# Altium schematic sheet OpAMP.SchDoc
size A4
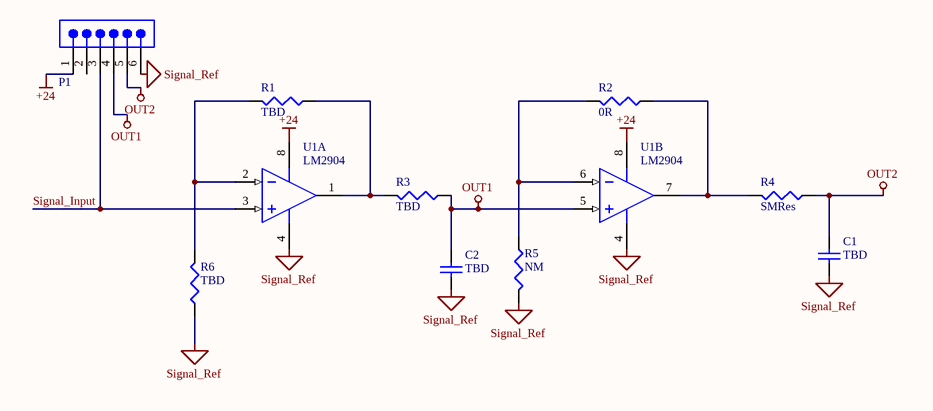
[diagram p0: OpAMP.SchDoc]

## Parts
C1  TBD  [WCAP-CSGP_0805_L2W1.25H0.6_Reflow]
C2  TBD  [WCAP-CSGP_0805_L2W1.25H0.6_Reflow]
P1  61300611121  [61300611121]  (value not drawn)
R1  TBD  [SM/R_1206]
R2  0R  [SM/R_1206]
R3  TBD  [SM/R_1206]
R4  SMRes  [SM/R_1206]
R5  NM  [SM/R_1206]
R6  TBD  [SM/R_1206]
U1  LM2904  [SO8_N]  (parts A,B of 2)

## Nets
+24: P1.1 U1.8(V+)
OUT1: C2.2 P1.4 R3.1 U1.5(IN+)
OUT2: C1.2 P1.5 R4.1
Signal_Ref: C1.1 C2.1 P1.6 R5.2 R6.1 U1.4(V-)
Signal_Input: P1.3 U1.3(IN+)
NetR1_1: R1.1 R3.2 U1.1(OUT)
NetR1_2: R1.2 R6.2 U1.2(IN-)
NetR2_1: R2.1 R4.2 U1.7(OUT)
NetR2_2: R2.2 R5.1 U1.6(IN-)

Not connected (* = marked no-connect by the designer): P1 2

## Library data of the parts
C1 C2 = 885012007032: WCAP-CSGP Multilayer Ceramic Chip Capacitor, General Purpose, size 0805, NP0, 47pF, 25VDC; Manufacturer: Wurth Elektronik; Case/Size Code: 0805; Capacitance Tolerance: +/-5%; Insulation Resistance: 10GΩ; Q Factor: 1000; Rated Voltage (DC): 25V; Technical Reference: NP00805470J025DFCT10000; Manufacturer Part Number: 885012007032; Category: Multilayer Ceramic Chip Capacitors; Match Code: WCAP-CSGP; ComponentLink1Description: Website Link; ComponentLink1URL: https://www.we-online.com/redexpert/article/885012007032?ad; ComponentLink2Description: Datasheet Link; ComponentLink2URL: https://www.we-online.com/redexpert/spec/885012007032?ad; Mount: Surface Mount; Operating Temperature Max: 125°C; Operating Temperature Min: -55°C; Packaging: Tape and Reel; Length: 2mm; Width: 1.25mm; Height: 0.6mm; Capacitance: 47pF; Ceramic Type: NP0
P1 = 61300611121: WR-PHD Pin Header, THT, Vertical, pitch 2.54mm, 1 Row, 6P; Manufacturer: Wurth Elektronik; Contact Resistance: 20mΩ; Rated Current: 3A; Working Voltage: 250V; Withstanding Voltage: 500V; ComponentLink1Description: Website Link; ComponentLink1URL: https://www.we-online.com/redexpert/article/61300611121?ad; ComponentLink2Description: Datasheet Link; ComponentLink2URL: https://www.we-online.com/redexpert/spec/61300611121?ad; Manufacturer Part Number: 61300611121; Category: Board-to-Board Connectors; Match Code: WR-PHD; Mount: Through Hole; Operating Temperature Max: 105°C; Operating Temperature Min: -40°C; Packaging: Bag; Gender: Pin Header; Number of Pins: 6; Number of Rows: 1; Orientation: Vertical; Pitch: 2.54mm
R1-R6 = SMRes: SMD Resistor; Mounting: SMD; RoHS: Yes; Category: Chip SMD Resistors; Stock 1: 1; Pricing 1: 10=0.67400, 100=0.52000, 250=0.49300, 500=0.33100, 1000=0.28900 (USD); Mount: Surface Mount; Number of Pins: 2; Resistor Type: FIXED RESISTOR
U1 = LM2903D: Low-Power Dual Voltage Comparator; Published: 24-Aug-2001; LatestRevisionDate: 13-Apr-2006; LatestRevisionNote: IPC-7351 Footprint Added.; DatasheetVersion: Oct-1999; PackageVersion: Dec-2002; PackageReference: SO8; Publisher: Altium Limited; PackageDescription: 8-Pin Small Outline Integrated Circuit 1.27 mm Pitch; Code_JEDEC: MS-012-AA; Code_IPC: SOIC127P600-8; ComponentLink1Description: Manufacturer Link; ComponentLink1URL: http://www.st.com/; ComponentLink2Description: Datasheet; ComponentLink2URL: http://www.st.com/stonline/products/literature/ds/2470/lm2903.pdf